# EAGLE schematic MOTOR_DRIVER (EAGLE 8.0.0)

## Sheet 1 of 3: Motor Driver Schematic
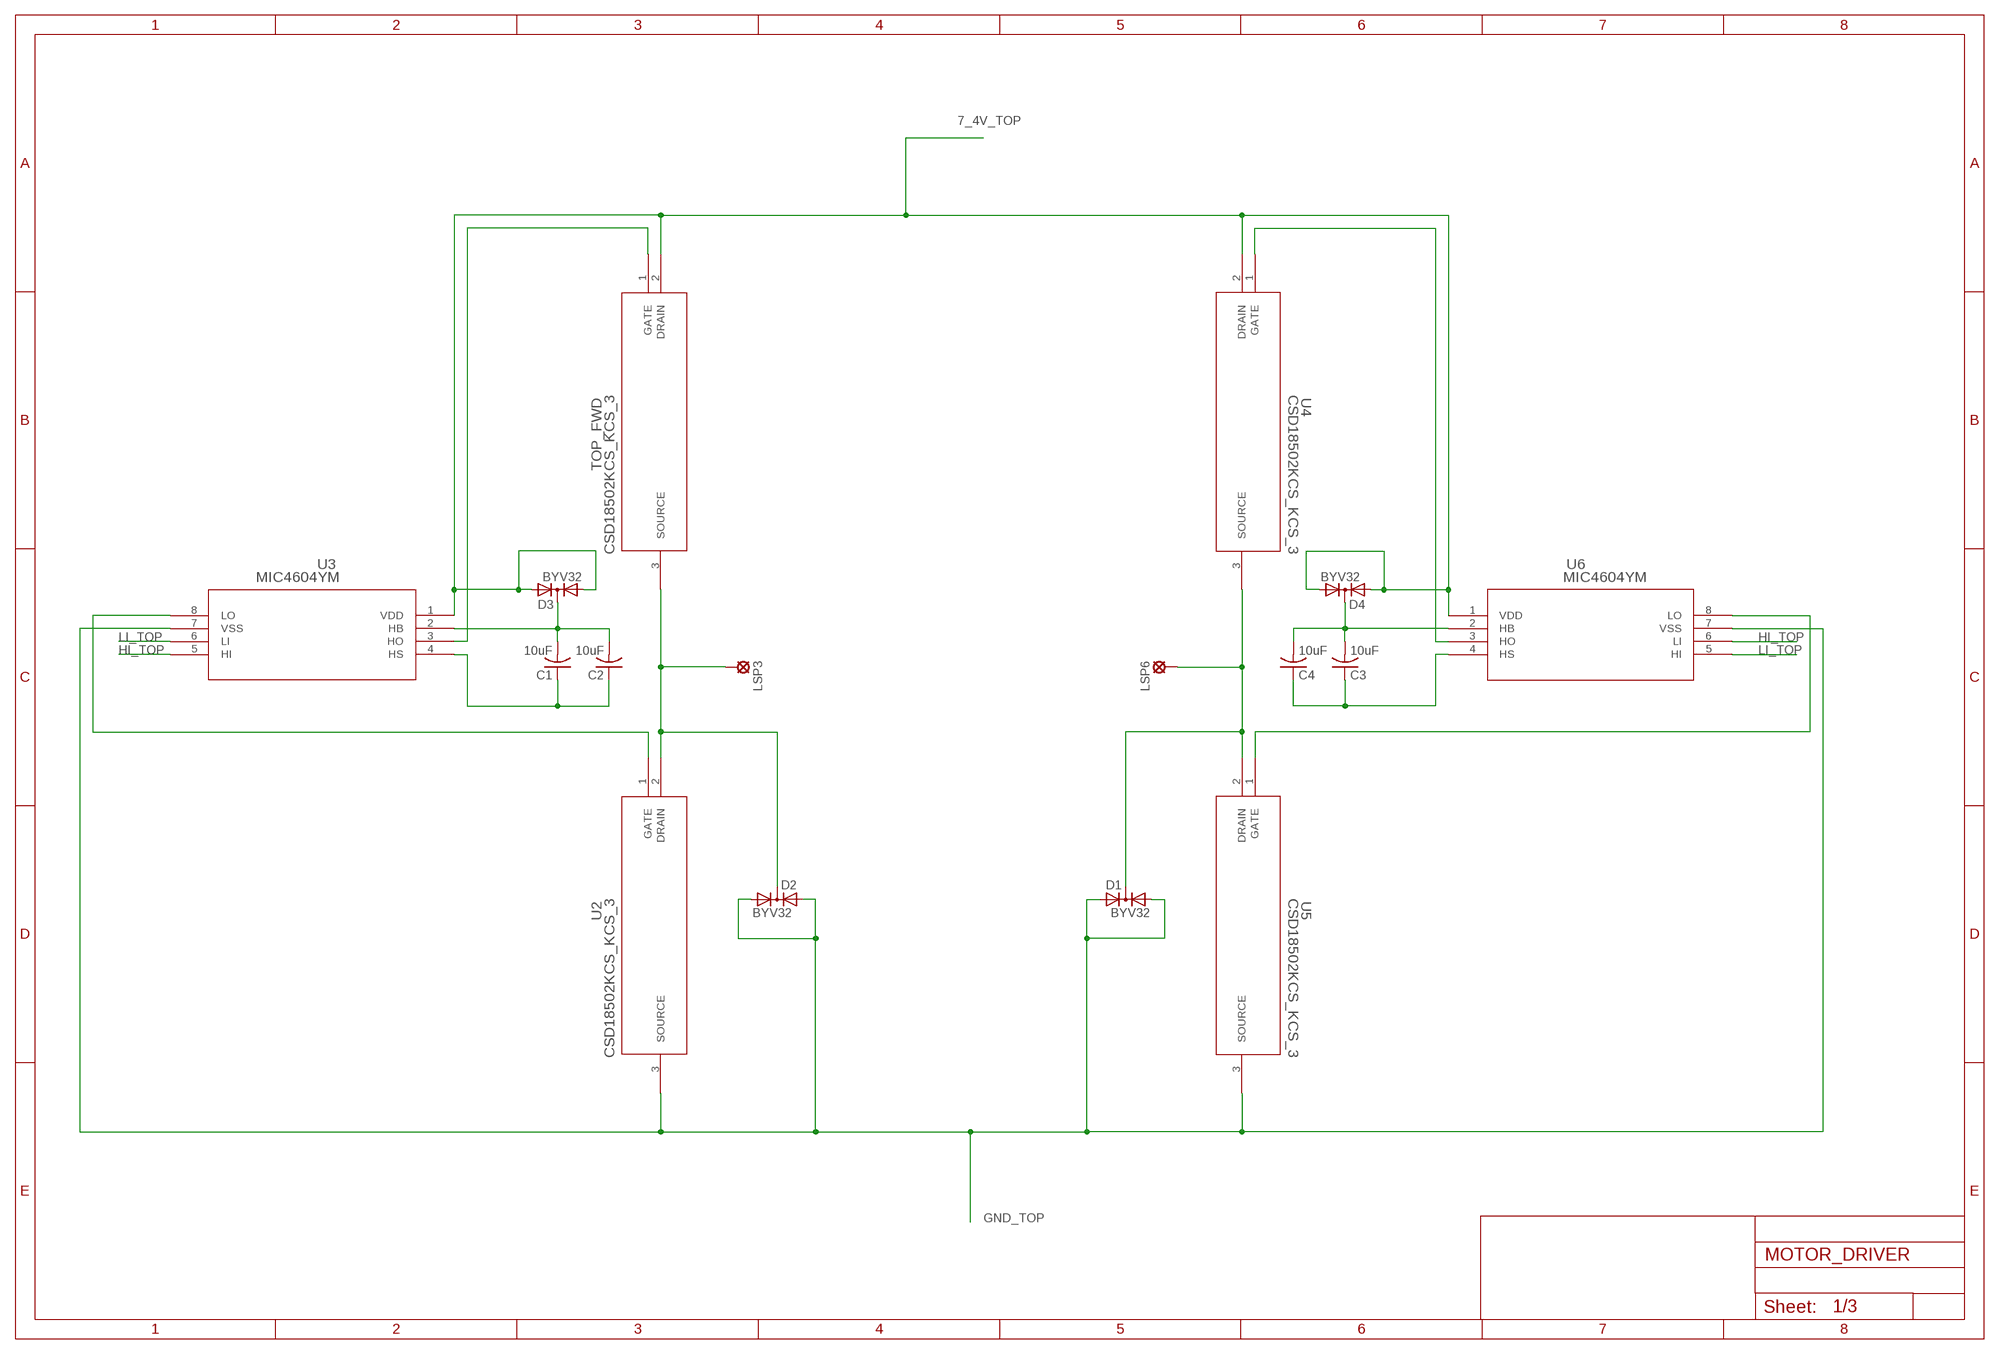
[diagram p0: schematic, sheet 1]

### Parts
C1  10uF  C-US025-050X050  [C025-050X050]
C2  10uF  C-US025-050X050  [C025-050X050]
C3  10uF  C-US025-050X050  [C025-050X050]
C4  10uF  C-US025-050X050  [C025-050X050]
D1  BYV32  [TO220ABS]
D2  BYV32  [TO220ABS]
D3  BYV32  [TO220ABS]
D4  BYV32  [TO220ABS]
LSP3  SE14  [SE14]
LSP6  SE14  [SE14]
TOP_FWD  CSD18502KCS_KCS_3  [KCS3]
U2  CSD18502KCS_KCS_3  [KCS3]
U3  MIC4604YM  [SOIC-8_M]
U4  CSD18502KCS_KCS_3  [KCS3]
U5  CSD18502KCS_KCS_3  [KCS3]
U6  MIC4604YM  [SOIC-8_M]

### Nets
7_4V_TOP: D3.A1 D3.A2 D4.A1 D4.A2 TOP_FWD.2(DRAIN) U3.1(VDD) U4.2(DRAIN) U6.1(VDD) ; also sheet 3
GND_TOP: D1.A1 D1.A2 D2.A1 D2.A2 U2.3(SOURCE) U3.7(VSS) U5.3(SOURCE) U6.7(VSS) ; also sheet 3
HI_TOP: U3.5(HI) U6.6(LI) ; also sheet 3
LI_TOP: U3.6(LI) U6.5(HI) ; also sheet 3
N$1: D2.C LSP3.MP TOP_FWD.3(SOURCE) U2.2(DRAIN)
N$2: U2.1(GATE) U3.8(LO)
N$3: TOP_FWD.1(GATE) U3.3(HO)
N$4: C1.1 C2.1 U3.4(HS)
N$5: C1.2 C2.2 D3.C U3.2(HB)
N$8: D1.C LSP6.MP U4.3(SOURCE) U5.2(DRAIN)
N$9: U5.1(GATE) U6.8(LO)
N$10: U4.1(GATE) U6.3(HO)
N$11: C3.1 C4.1 U6.4(HS)
N$12: C3.2 C4.2 D4.C U6.2(HB)

## Sheet 2 of 3: Microcontroller schematic
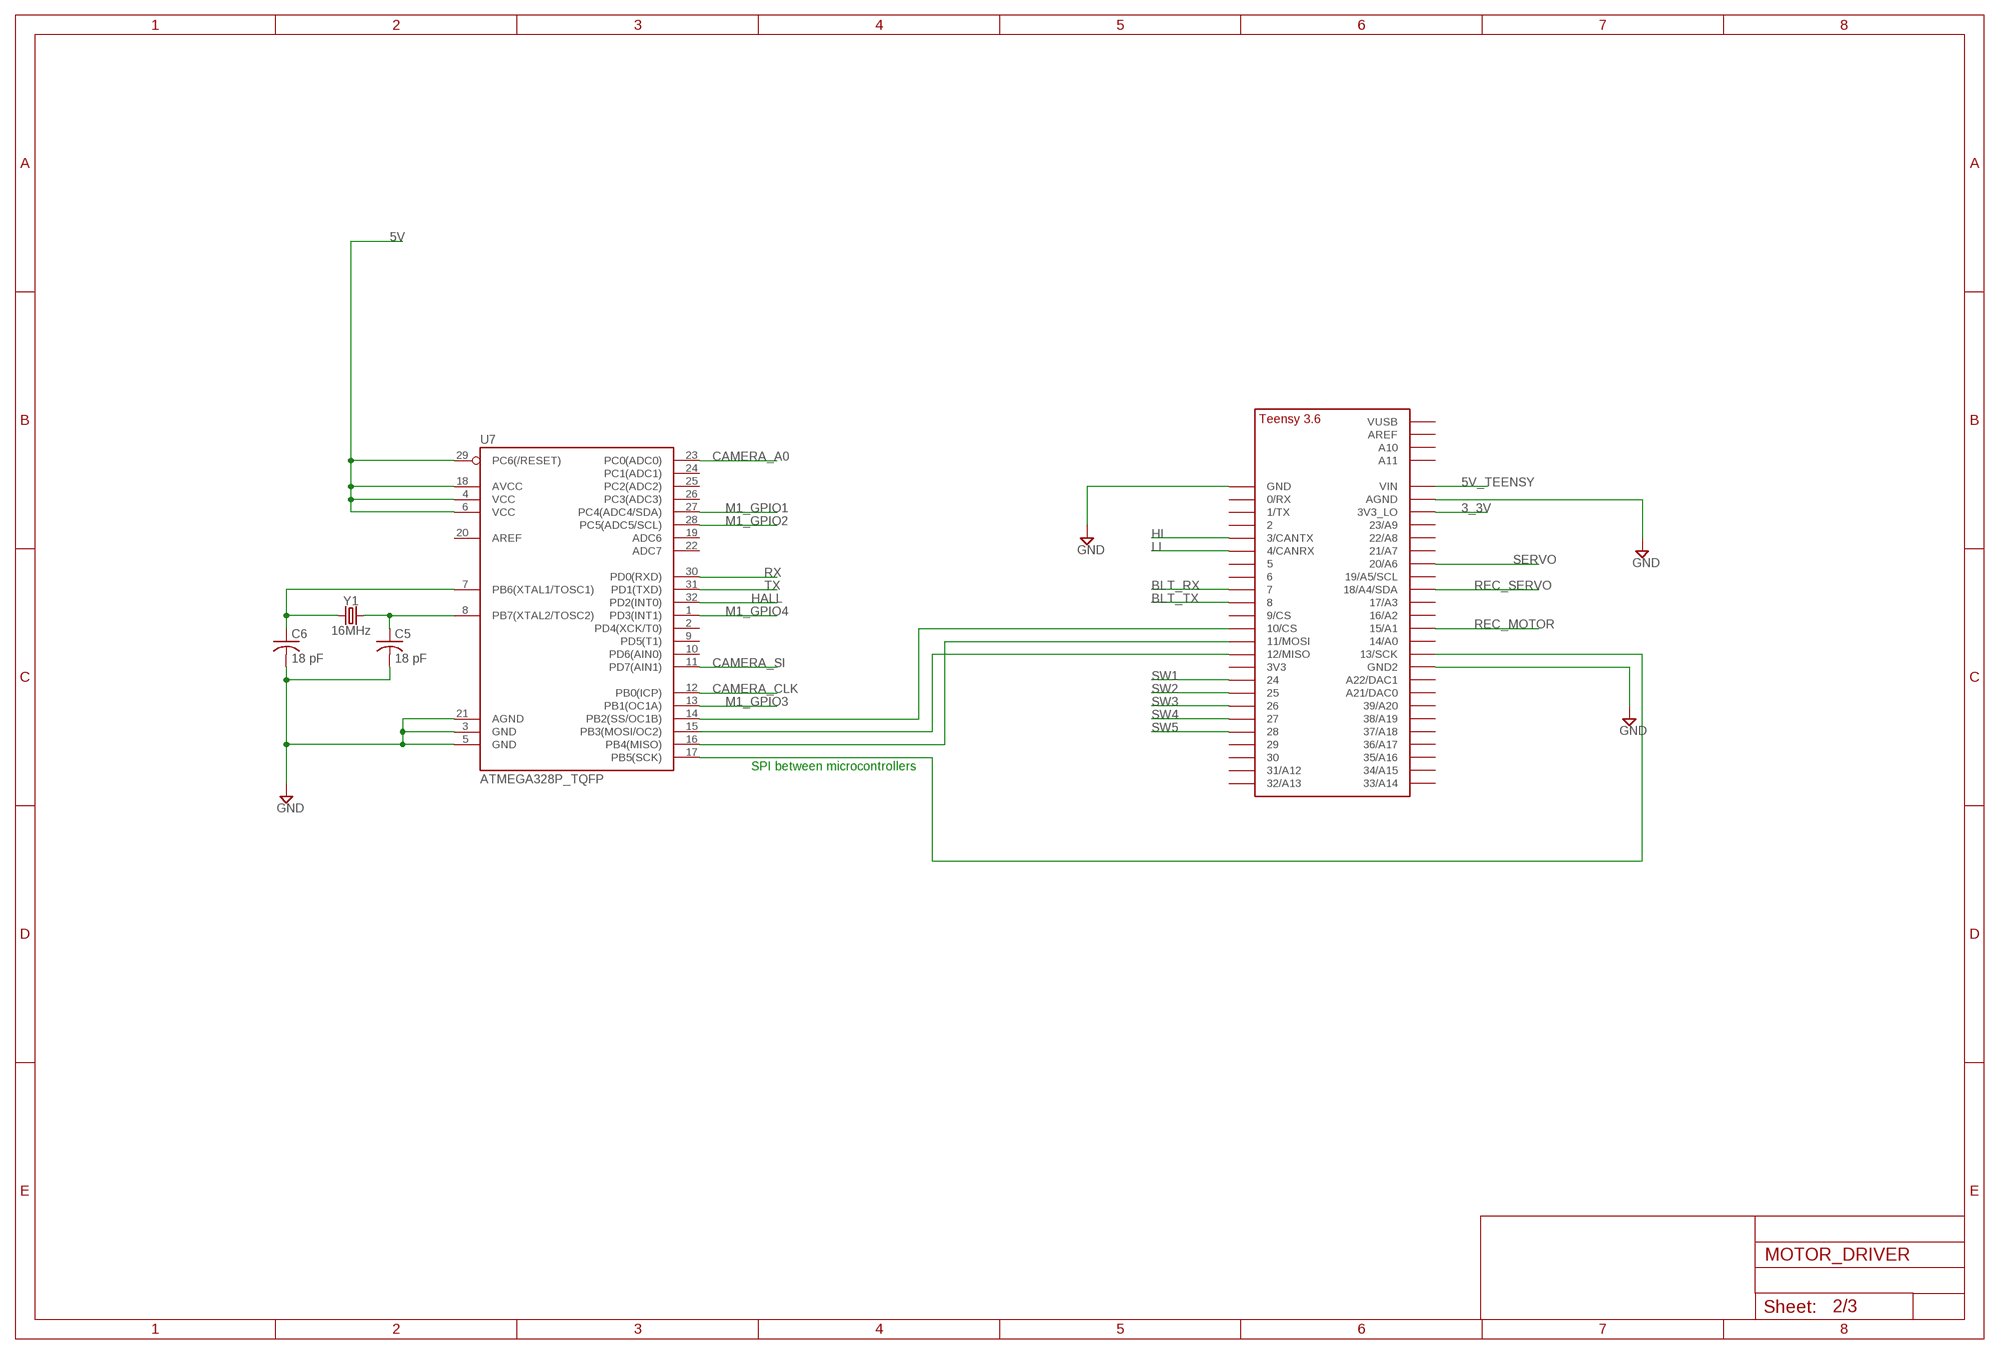
[diagram p1: schematic, sheet 2]

### Parts
C5  18 pF  C-US025-024X044  [C025-024X044]
C6  18 pF  C-US025-024X044  [C025-024X044]
U7  ATMEGA328P_TQFP  [TQFP32-08]
U$1  TEENSY_3.5/3.6_BASIC  [TEENSY_3.5/3.6_BASIC]
Y1  16MHz  CRYSTAL-16MHZPTH-HC49US  [HC49US]

### Nets
3_3V: U$1.3V3_LO
5V: U7.4(VCC) U7.6(VCC) U7.18(AVCC) U7.29(PC6(/RESET)) ; also sheet 3
5V_TEENSY: U$1.VIN ; also sheet 3
BLT_RX: U$1.7
BLT_TX: U$1.8
CAMERA_A0: U7.23(PC0(ADC0))
CAMERA_CLK: U7.12(PB0(ICP))
CAMERA_SI: U7.11(PD7(AIN1))
GND: C5.2 C6.2 U7.3(GND) U7.5(GND) U7.21(AGND) U$1.AGND U$1.GND U$1.GND2 ; also sheet 3
HALL: U7.32(PD2(INT0))
HI: U$1.3/CANTX ; also sheet 3
LI: U$1.4/CANRX ; also sheet 3
M1_GPIO1: U7.27(PC4(ADC4/SDA))
M1_GPIO2: U7.28(PC5(ADC5/SCL))
M1_GPIO3: U7.13(PB1(OC1A))
M1_GPIO4: U7.1(PD3(INT1))
N$6: C6.1 U7.7(PB6(XTAL1/TOSC1)) Y1.1
N$7: C5.1 U7.8(PB7(XTAL2/TOSC2)) Y1.2
N$13: U7.14(PB2(SS/OC1B)) U$1.10/CS
N$15: U7.15(PB3(MOSI/OC2)) U$1.12/MISO
N$16: U7.17(PB5(SCK)) U$1.13/SCK
N$18: U7.16(PB4(MISO)) U$1.11/MOSI
REC_MOTOR: U$1.15/A1
REC_SERVO: U$1.18/A4/SDA
RX: U7.30(PD0(RXD))
SERVO: U$1.20/A6
SW1: U$1.24 ; also sheet 3
SW2: U$1.25 ; also sheet 3
SW3: U$1.26 ; also sheet 3
SW4: U$1.27 ; also sheet 3
SW5: U$1.28 ; also sheet 3
TX: U7.31(PD1(TXD))
Unconnected: U7.2(PD4(XCK/T0)) U7.9(PD5(T1)) U7.10(PD6(AIN0)) U7.19(ADC6) U7.20(AREF) U7.22(ADC7) U7.24(PC1(ADC1)) U7.25(PC2(ADC2)) U7.26(PC3(ADC3)) U$1.0/RX U$1.1/TX U$1.2 U$1.3V3 U$1.5 U$1.6 U$1.9/CS U$1.14/A0 U$1.16/A2 U$1.17/A3 U$1.19/A5/SCL U$1.21/A7 U$1.21/DAC0(A21/DAC0) U$1.22/A8 U$1.23/A9 U$1.29 U$1.30 U$1.31/A12 U$1.32/A13 U$1.33/A14 U$1.34/A15 U$1.35/A16 U$1.36/A17 U$1.37/A18 U$1.38/A19 U$1.39/A20 U$1.A10 U$1.A11 U$1.A22/DAC1 U$1.AREF U$1.VUSB

### Notes on the sheet
- SPI between microcontrollers

## Sheet 3 of 3: Sensor schematic
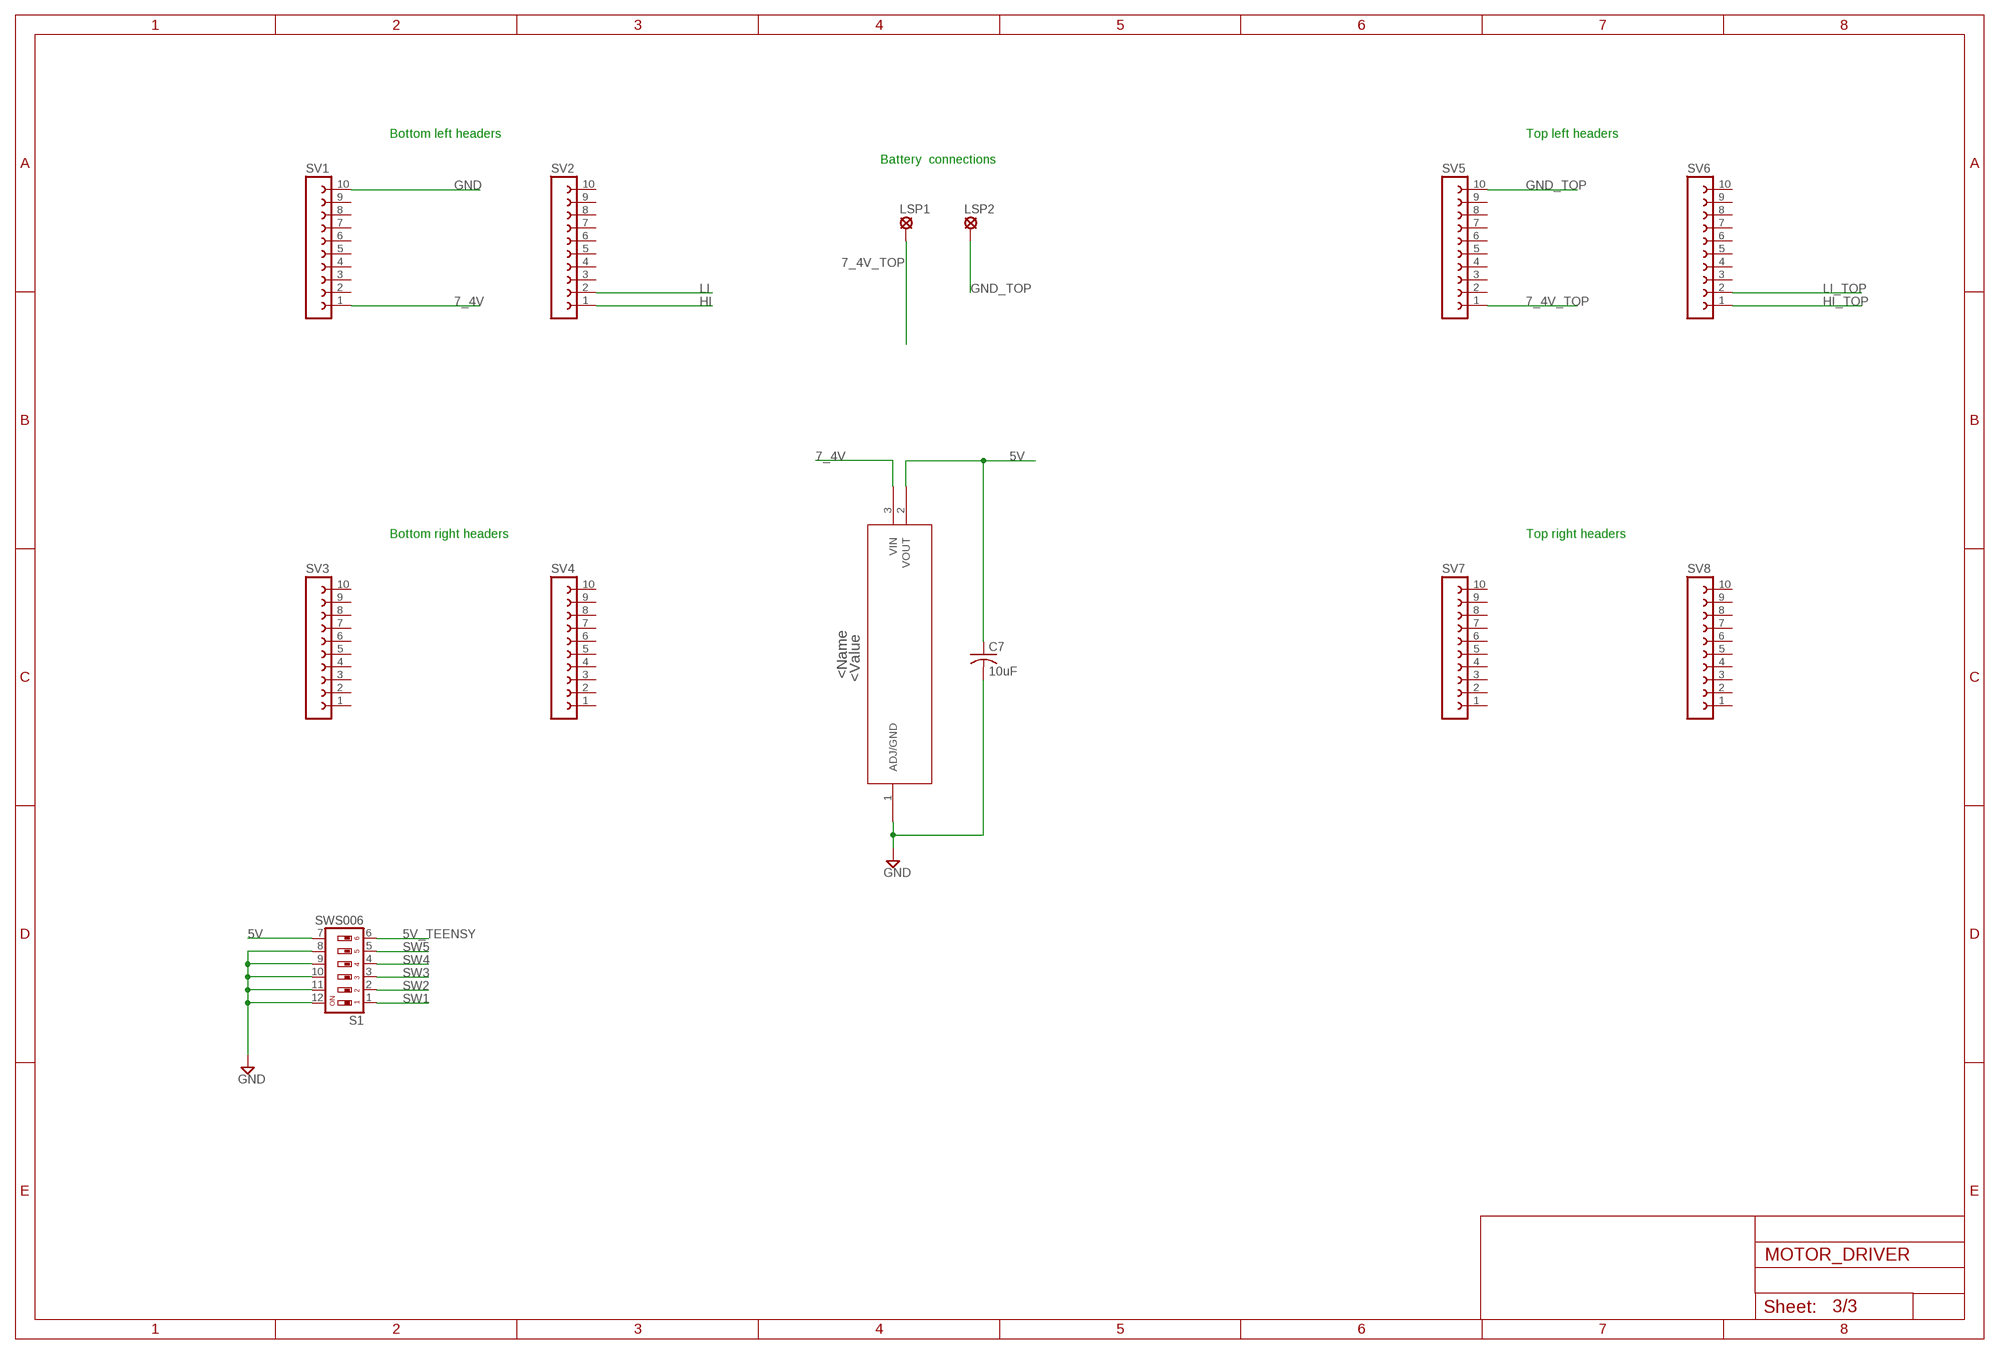
[diagram p2: schematic, sheet 3]

### Parts
C7  10uF  C-US050-025X075  [C050-025X075]
LSP1  SE14  [SE14]
LSP2  SE14  [SE14]
S1  SWS006  [SMS-006]
SV1  FE10-1  [FE10]
SV2  FE10-1  [FE10]
SV3  FE10-1  [FE10]
SV4  FE10-1  [FE10]
SV5  FE10-1  [FE10]
SV6  FE10-1  [FE10]
SV7  FE10-1  [FE10]
SV8  FE10-1  [FE10]
U$2  LM1086IT-5.0/NOPB  [T03B]

### Nets
5V: C7.1 S1.7 U$2.2(VOUT) ; also sheet 2
5V_TEENSY: S1.6 ; also sheet 2
7_4V: SV1.1 U$2.3(VIN)
7_4V_TOP: LSP1.MP SV5.1 ; also sheet 1
GND: C7.2 S1.8 S1.9 S1.10 S1.11 S1.12 SV1.10 U$2.1(ADJ/GND) ; also sheet 2
GND_TOP: LSP2.MP SV5.10 ; also sheet 1
HI: SV2.1 ; also sheet 2
HI_TOP: SV6.1 ; also sheet 1
LI: SV2.2 ; also sheet 2
LI_TOP: SV6.2 ; also sheet 1
SW1: S1.1 ; also sheet 2
SW2: S1.2 ; also sheet 2
SW3: S1.3 ; also sheet 2
SW4: S1.4 ; also sheet 2
SW5: S1.5 ; also sheet 2
Unconnected: SV1.2 SV1.3 SV1.4 SV1.5 SV1.6 SV1.7 SV1.8 SV1.9 SV2.3 SV2.4 SV2.5 SV2.6 SV2.7 SV2.8 SV2.9 SV2.10 SV3.1 SV3.2 SV3.3 SV3.4 SV3.5 SV3.6 SV3.7 SV3.8 SV3.9 SV3.10 SV4.1 SV4.2 SV4.3 SV4.4 SV4.5 SV4.6 SV4.7 SV4.8 SV4.9 SV4.10 SV5.2 SV5.3 SV5.4 SV5.5 SV5.6 SV5.7 SV5.8 SV5.9 SV6.3 SV6.4 SV6.5 SV6.6 SV6.7 SV6.8 SV6.9 SV6.10 SV7.1 SV7.2 SV7.3 SV7.4 SV7.5 SV7.6 SV7.7 SV7.8 SV7.9 SV7.10 SV8.1 SV8.2 SV8.3 SV8.4 SV8.5 SV8.6 SV8.7 SV8.8 SV8.9 SV8.10

### Notes on the sheet
- Bottom left headers | Top left headers
- Battery  connections
- Bottom right headers | Top right headers

## Library data of the parts
C1-C7 = resistor:C-US: CAPACITOR, American symbol
D1-D4 = diode:BYV32: DIODE 2 x Si diode 200 V, 20 A/230 Apeak, 25 ns
LSP1-LSP3 LSP6 = solpad:SE14: SOLDER PAD E1553, drill 1,4mm, distributor Buerklin, 07F820
S1 = smd-special:SWS006: SMD Dip Switch 6 pol.
SV1-SV8 = con-lsta:FE10-1: FEMALE HEADER; OC_FARNELL: unknown; OC_NEWARK: unknown
TOP_FWD U2 U4 U5 = CSD18502KCS:CSD18502KCS_KCS_3; MANUFACTURER_PART_NUMBER: csd18502kcs_kcs_3; VENDOR: TEXAS INSTRUMENTS
U3 U6 = MIC4604:MIC4604YM; MANUFACTURER_PART_NUMBER: mic4604ym; VENDOR: Microchip
U7 = SparkFun-IC-Microcontroller:ATMEGA328P_TQFP: Popular 328P in QFP Storefront component: ATmega328 - TQFP <https://www.sparkfun.com/products/13448> (COM-13448) Datasheet <http://www.sparkfun.com/datasheets/Components/SMD/ATMega328.pdf> SparkFun Products SparkFun RedBoard - Programmed with Arduino <https://www.sparkfun.com/products/12757> (DEV-12757) Arduino Pro Mini 328 - 5V/16MHz <https://www.sparkfun.com/products/11113> (DEV-11113) Arduino Pro Mini 328 - 3.3V/8MHz <https://www.sparkfun.com/products/11114> (DEV-11114) SparkFun OpenLog <https://www.sparkfun.com/products/13712> (DEV-13712) SparkFun MicroView - OLED Arduino Module <https://www.sparkfun.com/products/12923> (DEV-12923) SparkFun Digital Sandbox <https://www.sparkfun.com/products/12651> (DEV-12651) SparkFun PicoBoard <https://www.sparkfun.com/products/11888> (WIG-11888) Arduino Fio <https://www.sparkfun.com/products/10116> (DEV-10116) LilyPad Arduino 328 Main Board <https://www.sparkfun.com/products/13342> (DEV-13342) SparkFun RedStick <https://www.sparkfun.com/products/13741> (DEV-13741) LilyPad MP3 <https://www.sparkfun.com/products/11013> (DEV-11013) LilyPad Arduino SimpleSnap <https://www.sparkfun.com/products/10941> (DEV-10941) SparkFun Stepoko <https://www.sparkfun.com/products/13899> (ROB-13899) SparkFun Geiger Counter <https://www.sparkfun.com/products/11345> (SEN-11345) SparkFun EL Sequencer <https://www.sparkfun.com/products/12781> (COM-12781) Arduino Pro 328 - 5V/16MHz <https://www.sparkfun.com/products/10915> (DEV-10915) CryptoCape <https://www.sparkfun.com/products/12773> (DEV-12773) SparkFun IR Thermometer Evaluation Board - MLX90614 <https://www.sparkfun.com/products/10740> (SEN-10740) SparkFun RedBot Mainboard <https://www.sparkfun.com/products/12097> (ROB-12097) Arduino Pro 328 - 3.3V/8MHz <https://www.sparkfun.com/products/10914> (DEV-10914) SparkFun Block for Intel® Edison - Arduino <https://www.sparkfun.com/products/13036> (DEV-13036) SparkFun Simon Says - Surface Mount Soldering Kit <https://www.sparkfun.com/products/10935> (KIT-10935) SparkFun 7-Segment Serial Display - Red <https://www.sparkfun.com/products/11441> (COM-11441) SparkFun 7-Segment Serial Display - White <https://www.sparkfun.com/products/11629> (COM-11629) SparkFun 7-Segment Serial Display - Yellow <https://www.sparkfun.com/products/11443> (COM-11443) SparkFun 7-Segment Serial Display - Kelly Green <https://www.sparkfun.com/products/11440> (COM-11440) SparkFun 7-Segment Serial Display - Blue <https://www.sparkfun.com/products/11442> (COM-11442) SparkFun OpenSegment Serial Display - 20mm (Blue) <https://www.sparkfun.com/products/11647> (COM-11647) SparkFun OpenSegment Serial Display - 20mm (Green) <https://www.sparkfun.com/products/11646> (COM-11646) SparkFun OpenSegment Serial Display - 20mm (White) <https://www.sparkfun.com/products/11648> (COM-11648) SparkFun OpenSegment Serial Display - 20mm (Red) <https://www.sparkfun.com/products/11644> (COM-11644) SparkFun OpenSegment Serial Display - 20mm (Yellow) <https://www.sparkfun.com/products/11645> (COM-11645) SparkFun OpenSegment Shield <https://www.sparkfun.com/products/13190> (DEV-13190); PROD_ID: IC-09069
U$1 = Teensy356:TEENSY_3.5/3.6_BASIC
U$2 = TI1086:LM1086IT-5.0/NOPB; COPYRIGHT: Copyright C 2015 Accelerated Designs. All rights reserved; MANUFACTURER_PART_NUMBER: LM1086IT50; VENDOR: National Semiconductor
Y1 = SparkFun-Clocks:CRYSTAL-16MHZ: 16MHz Crystal Digikey Example <http://www.digikey.com/product-search/en?keywords=535-9122-1-ND> Frequency: 16MHz Frequency Stability: ±50ppm Frequency Tolerance: ±20ppm Load Capacitance: 18pF SparkFun Products: Pro Micro -5V/16MHz <https://www.sparkfun.com/products/12640> SparkFun Serial Enabled LCD Kit <https://www.sparkfun.com/products/10097>; PROD_ID: XTAL-08181; SF_ID: COM-00536